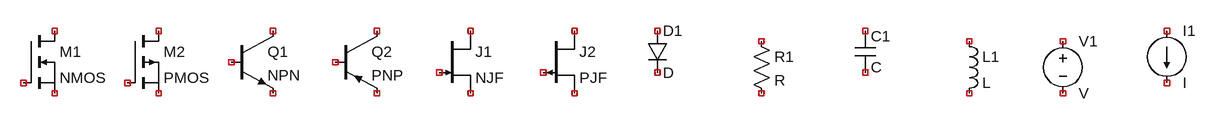
[diagram p0: schematic boilerplate.asc]
boilerplate.asc, the LTspice schematic file:
Version 4
SHEET 1 880 680
SYMBOL nmos 0 96 R0
SYMATTR InstName M1
SYMBOL pmos 160 96 R0
SYMATTR InstName M2
SYMBOL npn 320 96 R0
SYMATTR InstName Q1
SYMBOL pnp 480 96 R0
SYMATTR InstName Q2
SYMBOL njf 640 96 R0
SYMATTR InstName J1
SYMBOL pjf 800 96 R0
SYMATTR InstName J2
SYMBOL diode 960 96 R0
SYMATTR InstName D1
SYMBOL res 1120 96 R0
SYMATTR InstName R1
SYMBOL cap 1280 96 R0
SYMATTR InstName C1
SYMBOL ind 1440 96 R0
SYMATTR InstName L1
SYMBOL voltage 1600 96 R0
SYMATTR InstName V1
SYMBOL current 1760 96 R0
SYMATTR InstName I1

The netlist it stands for:
* boilerplate.asc
M1 NC_01 NC_02 NC_03 NC_03 NMOS
M2 NC_04 NC_05 NC_06 NC_06 PMOS
Q1 NC_07 NC_08 NC_09 0 NPN
Q2 NC_10 NC_11 NC_12 0 PNP
J1 NC_13 NC_14 NC_15 NJF
J2 NC_16 NC_17 NC_18 PJF
D1 NC_19 NC_20 D
R1 NC_21 NC_22 R
C1 NC_23 NC_24 C
L1 NC_25 NC_26 L
V1 NC_27 NC_28 V
I1 NC_29 NC_30 I
.model D D
.lib standard.dio
.model NPN NPN
.model PNP PNP
.lib standard.bjt
.model NJF NJF
.model PJF PJF
.lib standard.jft
.model NMOS NMOS
.model PMOS PMOS
.lib standard.mos
.backanno
.end